# EAGLE design system_monitor (EAGLE 5.09)
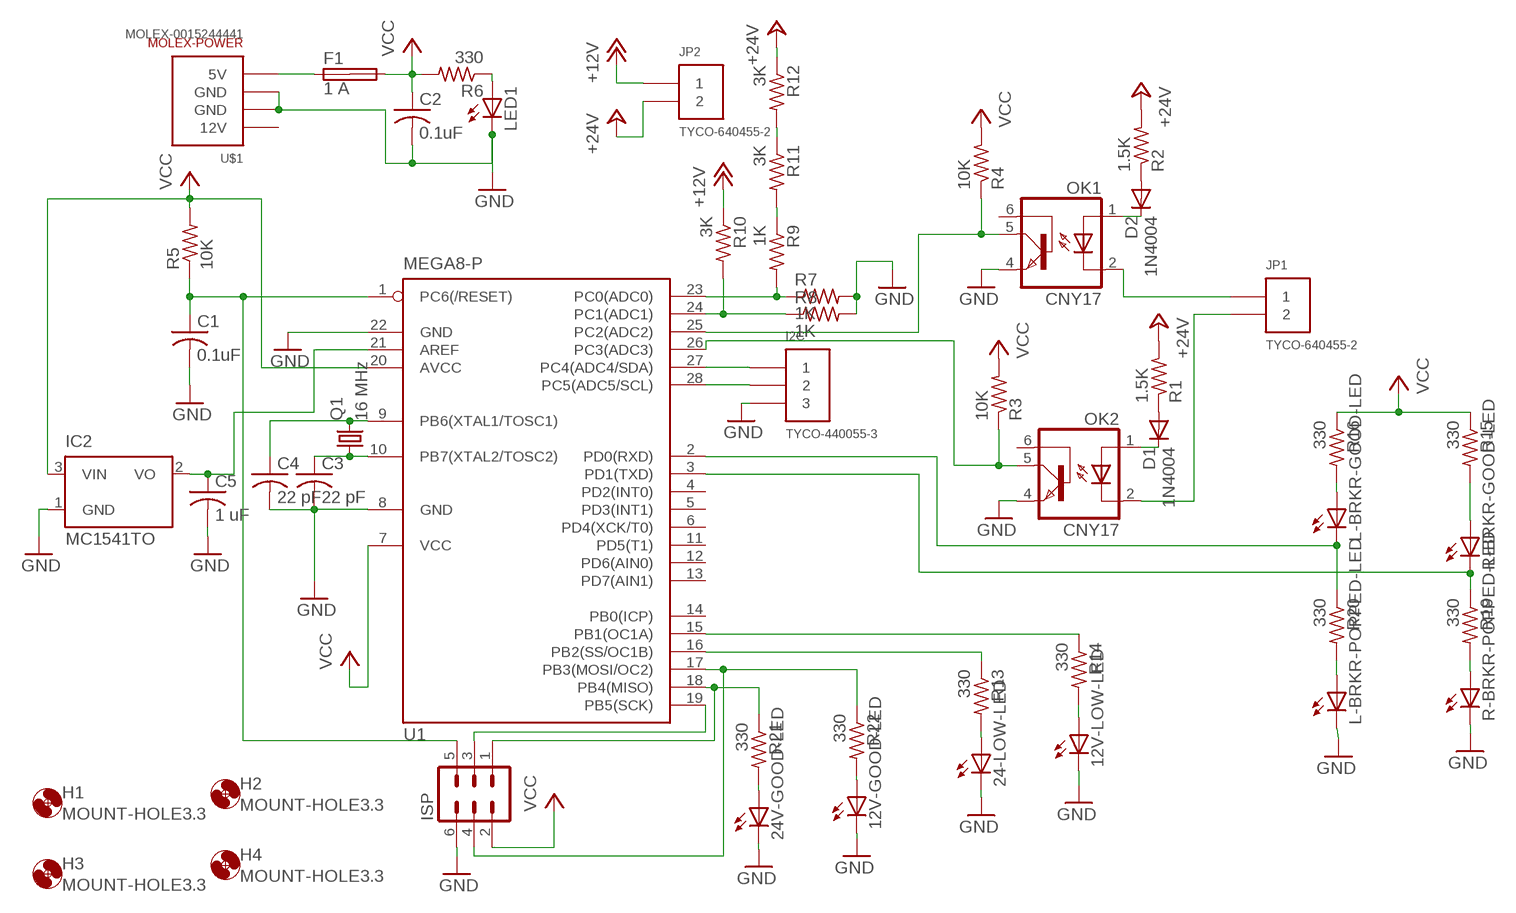
[diagram p0: schematic, sheet 1]

## Parts
12V-GOOD-LED  LED3MM  [LED3MM]
12V-LOW-LED  LED3MM  [LED3MM]
24-LOW-LED  LED3MM  [LED3MM]
24V-GOOD-LED  LED3MM  [LED3MM]
C1  0.1uF  C-US050-055X075  [C050-055X075]
C2  0.1uF  C-US050-055X075  [C050-055X075]
C3  22 pF  C-US025-025X050  [C025-025X050]
C4  22 pF  C-US025-025X050  [C025-025X050]
C5  1 uF  C-US050-025X075  [C050-025X075]
D1  1N4004  [DO41-10]
D2  1N4004  [DO41-10]
F1  1 A  SHK20Q  [SHK20Q]
H1  MOUNT-HOLE3.3  [3,3]
H2  MOUNT-HOLE3.3  [3,3]
H3  MOUNT-HOLE3.3  [3,3]
H4  MOUNT-HOLE3.3  [3,3]
I2C  TYCO-440055-3  [HEADER-RA-2.00MM-3]
IC2  MC1541TO  [TO92]
ISP  MA03-2  [MA03-2]
JP1  TYCO-640455-2  [HEADER-RA-POL-.100IN-2]
JP2  TYCO-640455-2  [HEADER-RA-POL-.100IN-2]
L-BRKR-GOOD-LED  LED3MM  [LED3MM]
L-BRKR-POPPED-LED  LED3MM  [LED3MM]
LED1  LED3MM  [LED3MM]
OK1  CNY17  [DIL06]
OK2  CNY17  [DIL06]
Q1  16 MHz  CRYSTALHC49S  [HC49/S]
R1  1.5K  R-US_0207/10  [0207/10]
R2  1.5K  R-US_0207/10  [0207/10]
R3  10K  R-US_0207/10  [0207/10]
R4  10K  R-US_0207/10  [0207/10]
R5  10K  R-US_0207/10  [0207/10]
R6  330  R-US_0207/10  [0207/10]
R7  1K  R-US_0207/10  [0207/10]
R8  1K  R-US_0207/10  [0207/10]
R9  1K  R-US_0207/10  [0207/10]
R10  3K  R-US_0207/10  [0207/10]
R11  3K  R-US_0207/10  [0207/10]
R12  3K  R-US_0207/10  [0207/10]
R13  330  R-US_0207/10  [0207/10]
R14  330  R-US_0207/10  [0207/10]
R15  330  R-US_0207/10  [0207/10]
R16  330  R-US_0207/10  [0207/10]
R19  330  R-US_0207/10  [0207/10]
R20  330  R-US_0207/10  [0207/10]
R21  330  R-US_0207/10  [0207/10]
R22  330  R-US_0207/10  [0207/10]
R-BRKR-GOOD-LED  LED3MM  [LED3MM]
R-BRKR-POPPED-LED  LED3MM  [LED3MM]
U1  MEGA8-P  [DIL28-3]
U$1  MOLEX-0015244441  [MOLEX-0015244441B]

## Nets
+12V: JP2.1 R10.1
+24V: JP2.2 R1.2 R2.2 R12.1
GND: 12V-GOOD-LED.K(C) 12V-LOW-LED.K(C) 24-LOW-LED.K(C) 24V-GOOD-LED.K(C) C1.2 C2.2 C3.2 C4.2 C5.2 I2C.3 IC2.1(GND) ISP.6 L-BRKR-POPPED-LED.K(C) LED1.K(C) OK1.4(EMI) OK2.4(EMI) R7.2 R8.2 R-BRKR-POPPED-LED.K(C) U1.8(GND) U1.22(GND) U$1.2(GND) U$1.3(GND)
N$1: D1.A R1.1
N$2: D2.A R2.1
N$3: D1.C OK2.1(A)
N$4: C1.1 ISP.5 R5.1 U1.1(PC6(/RESET))
N$5: C3.1 Q1.1 U1.10(PB7(XTAL2/TOSC2))
N$6: OK2.5(COL) R3.1 U1.26(PC3(ADC3))
N$7: C4.1 Q1.2 U1.9(PB6(XTAL1/TOSC1))
N$8: OK1.5(COL) R4.1 U1.25(PC2(ADC2))
N$9: F1.1A U$1.4(5V)
N$10: R8.1 R10.2 U1.24(PC1(ADC1))
N$11: R11.1 R12.2
N$12: R9.1 R11.2
N$13: I2C.1 U1.27(PC4(ADC4/SDA))
N$14: I2C.2 U1.28(PC5(ADC5/SCL))
N$15: R7.1 R9.2 U1.23(PC0(ADC0))
N$16: JP1.1 OK1.2(C)
N$17: JP1.2 OK2.2(C)
N$18: R13.1 U1.16(PB2(SS/OC1B))
N$19: R14.1 U1.15(PB1(OC1A))
N$20: 24V-GOOD-LED.A R21.2
N$21: 12V-GOOD-LED.A R22.2
N$22: D2.C OK1.1(A)
N$23: ISP.1 R21.1 U1.18(PB4(MISO))
N$24: C5.1 IC2.2(VO) U1.21(AREF)
N$25: L-BRKR-GOOD-LED.K(C) R20.1 U1.2(PD0(RXD))
N$26: R19.1 R-BRKR-GOOD-LED.K(C) U1.3(PD1(TXD))
N$27: 24-LOW-LED.A R13.2
N$28: LED1.A R6.1
N$29: 12V-LOW-LED.A R14.2
N$30: R15.2 R-BRKR-GOOD-LED.A
N$31: ISP.3 U1.19(PB5(SCK))
N$32: L-BRKR-POPPED-LED.A R20.2
N$33: ISP.4 R22.1 U1.17(PB3(MOSI/OC2))
N$34: L-BRKR-GOOD-LED.A R16.2
N$35: R19.2 R-BRKR-POPPED-LED.A
VCC: C2.1 F1.2A IC2.3(VIN) ISP.2 R3.2 R4.2 R5.2 R6.2 R15.1 R16.1 U1.7(VCC) U1.20(AVCC)
Unconnected: F1.1B F1.2B OK1.6(BAS) OK2.6(BAS) U1.4(PD2(INT0)) U1.5(PD3(INT1)) U1.6(PD4(XCK/T0)) U1.11(PD5(T1)) U1.12(PD6(AIN0)) U1.13(PD7(AIN1)) U1.14(PB0(ICP))

## Power pins joined to a net without a drawn wire
12V: U$1.1(12V)

## Library data of the parts
12V-GOOD-LED 12V-LOW-LED 24-LOW-LED 24V-GOOD-LED L-BRKR-GOOD-LED L-BRKR-POPPED-LED LED1 R-BRKR-GOOD-LED R-BRKR-POPPED-LED = led:LED: LED OSRAM: - CHIPLED LG R971, LG N971, LY N971, LG Q971, LY Q971, LO R971, LY R971 LH N974, LH R974 LS Q976, LO Q976, LY Q976 LO Q996 - Hyper CHIPLED LW Q18S LB Q993, LB Q99A, LB R99A - SideLED LS A670, LO A670, LY A670, LG A670, LP A670 LB A673, LV A673, LT A673, LW A673 LH A674 LY A675 LS A676, LA A676, LO A676, LY A676, LW A676 LS A679, LY A679, LG A679 - Hyper Micro SIDELED® LS Y876, LA Y876, LO Y876, LY Y876 LT Y87S - SmartLED LW L88C, LW L88S LB L89C, LB L89S, LG L890 LS L89K, LO L89K, LY L89K LS L896, LA L896, LO L896, LY L896 - TOPLED LS T670, LO T670, LY T670, LG T670, LP T670 LSG T670, LSP T670, LSY T670, LOP T670, LYG T670 LG T671, LOG T671, LSG T671 LB T673, LV T673, LT T673, LW T673 LH T674 LS T676, LA T676, LO T676, LY T676, LB T676, LH T676, LSB T676, LW T676 LB T67C, LV T67C, LT T67C, LS T67K, LO T67K, LY T67K, LW E67C LS E67B, LA E67B, LO E67B, LY E67B, LB E67C, LV E67C, LT E67C LW T67C LS T679, LY T679, LG T679 LS T770, LO T770, LY T770, LG T770, LP T770 LB T773, LV T773, LT T773, LW T773 LH T774 LS E675, LA E675, LY E675, LS T675 LS T776, LA T776, LO T776, LY T776, LB T776 LHGB T686 LT T68C, LB T68C - Hyper Mini TOPLED® LB M676 - Mini TOPLED Santana® LG M470 LS M47K, LO M47K, LY M47K Source: http://www.osram.convergy.de LUXEON: - LUMILED® LXK2-PW12-R00, LXK2-PW12-S00, LXK2-PW14-U00, LXK2-PW14-V00 LXK2-PM12-R00, LXK2-PM12-S00, LXK2-PM14-U00 LXK2-PE12-Q00, LXK2-PE12-R00, LXK2-PE12-S00, LXK2-PE14-T00, LXK2-PE14-U00 LXK2-PB12-K00, LXK2-PB12-L00, LXK2-PB12-M00, LXK2-PB14-N00, LXK2-PB14-P00, LXK2-PB14-Q00 LXK2-PR12-L00, LXK2-PR12-M00, LXK2-PR14-Q00, LXK2-PR14-R00 LXK2-PD12-Q00, LXK2-PD12-R00, LXK2-PD12-S00 LXK2-PH12-R00, LXK2-PH12-S00 LXK2-PL12-P00, LXK2-PL12-Q00, LXK2-PL12-R00 Source: www.luxeon.com KINGBRIGHT: KA-3528ASYC Source: www.kingbright.com
C1-C5 = resistor:C-US: CAPACITOR, American symbol
D1 D2 = diode:1N4004: DIODE general purpose rectifier, 1 A
F1 = fuse:SHK20Q: FUSE HOLDER 5 x 20 mm, SH contact, E1207 Buerklin 64G6061
H1-H4 = holes:MOUNT-HOLE: MOUNTING HOLE with drill center marker
I2C = chicagoedt:TYCO-440055-3: 3 pin right angle header with shroud and 2.00 mm pitch.
IC2 = microchip:MC15*: 2.5V and 4.096V Voltage References Source: http://www.microchip.com .. 21653b.pdf
ISP = con-lstb:MA03-2: PIN HEADER
JP1 JP2 = chicagoedt:TYCO-640455-2: 2 pin right angle header with polarizing tab and .100" pitch.
OK1 OK2 = optocoupler:CNY17: SIEMENS OPTO COUPLER
Q1 = crystal:CRYSTAL: CRYSTAL
R1-R16 R19-R22 = resistor:R-US_: RESISTOR, American symbol
U1 = atmel:MEGA8-P: MICROCONTROLLER 8 Kbytes FLASH, 1 kbytes SRAM, 512 bytes EEPROM, USART, 4-channel 10 bit ADC, 2-channel 8 bit ADC Pin compatible with Atmega48, ATMega88, ATMega168 Source: avr.lbr
U$1 = chicagoedt:MOLEX-0015244441: 5.08mm (.200") Pitch Disk Drive Power Connection System Header, Right Angle, Through Hole, 4 Circuits, Lead-free, 3.56mm (.140") PC Tail Length, with PCB Locator Peg

## Board
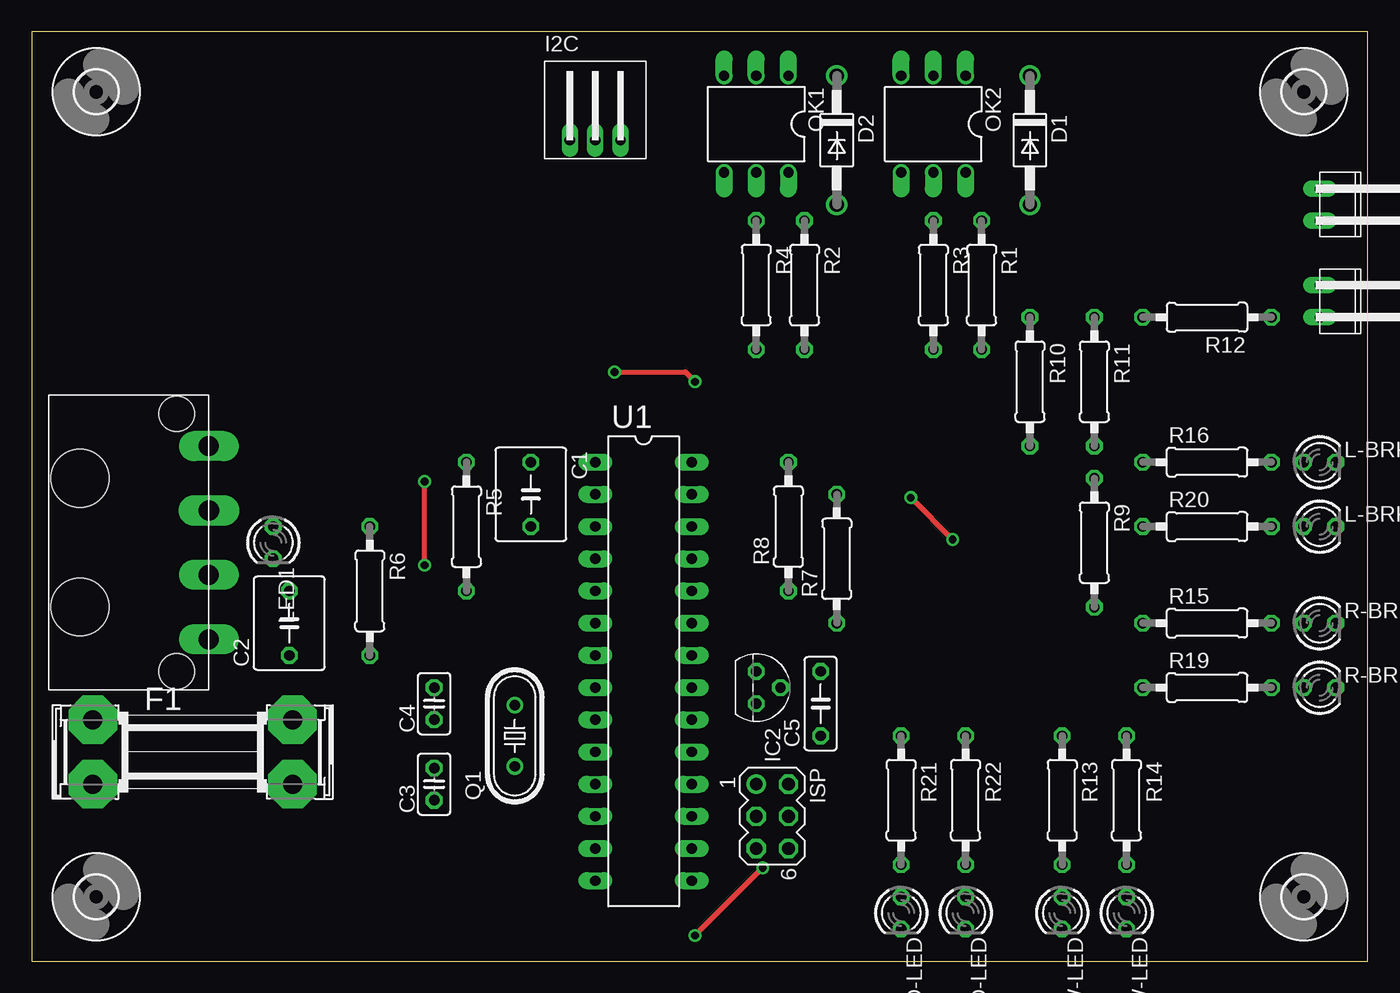
[diagram p1: board, top side]
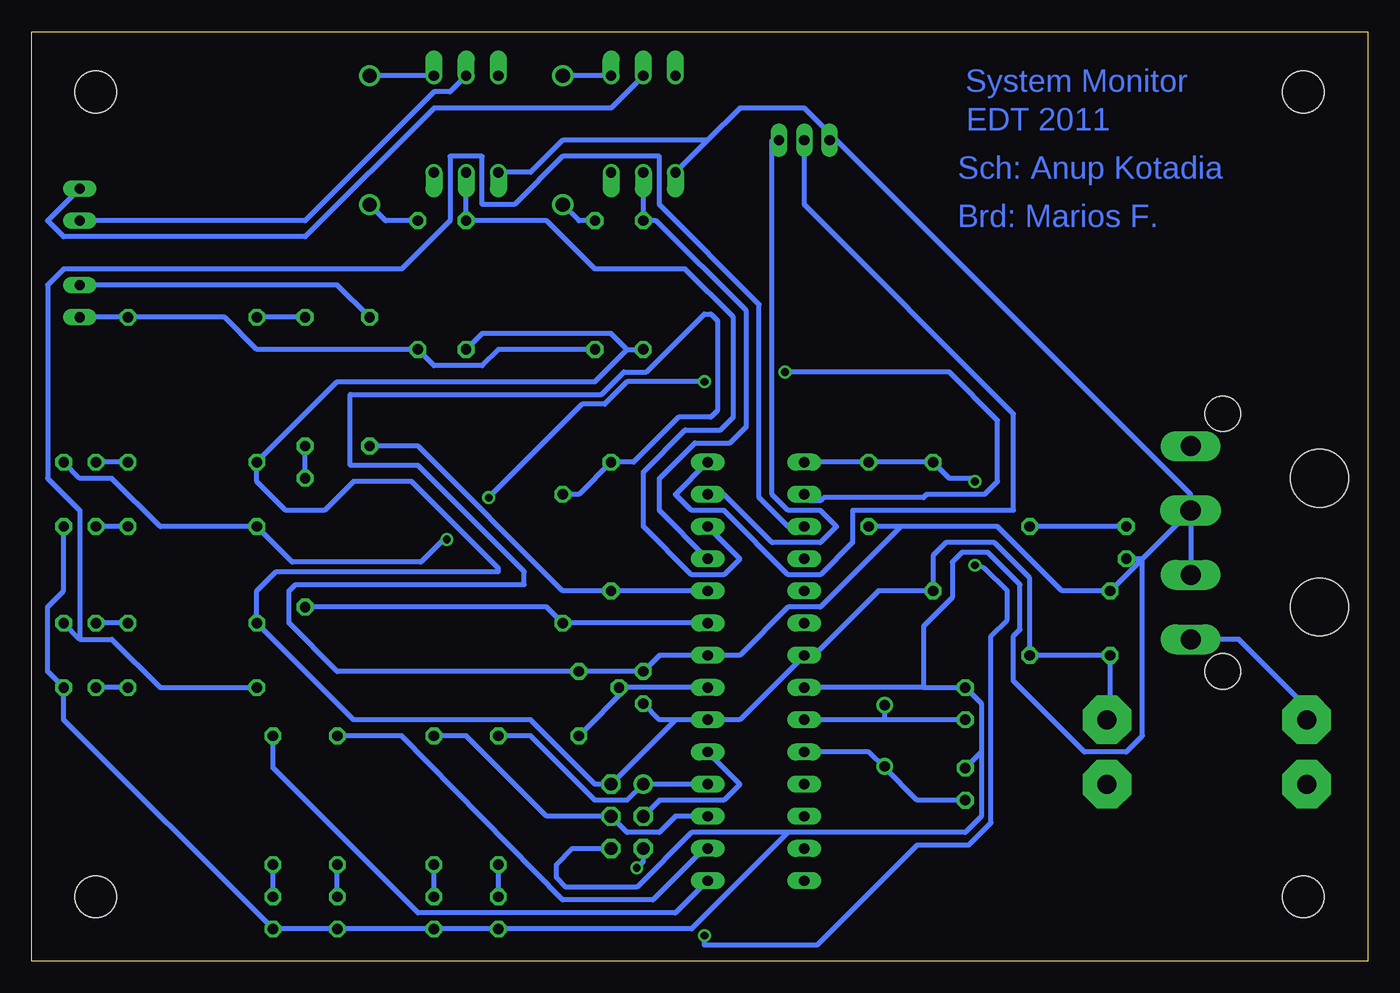
[diagram p2: board, bottom side, seen from below]

Size 105.39 x 73.33 mm. Coordinates in mm from the lower left corner, seen from the top.
Outline: 0,0 105.39,0 105.39,73.33 0,73.33 0,0
Copper layers (1*16): Top 0.035mm / dielectric 1.5mm / Bottom 0.035mm
Design rules "default *": minimum track width 16mil, minimum drill 24mil, track to track 12mil, track to pad 10mil, pad to pad 8mil, via to via 8mil, smd to smd 8mil, copper to edge 40mil, drill to drill 8mil, minimum pad ring 10mil, minimum via ring 8mil, stop-mask expansion 4mil, vias tented up to drill 0mil, thermal gap 10mil

### Footprints (pad centres in the part's own frame; a part is rotated, then mirrored left to right if it is on the bottom)
LED3MM = drill 0.813 octagon: A -1.27,0; K 1.27,0
C050-055X075 = drill 0.813 octagon: 1 -2.54,0; 2 2.54,0
C025-025X050 = drill 0.813 octagon: 1 -1.27,0; 2 1.27,0
C050-025X075 = drill 0.813 octagon: 1 -2.54,0; 2 2.54,0
DO41-10 = drill 1.118 round: A 5.08,0; C -5.08,0
SHK20Q = drill 1.5 pad 3.81 octagon: 1A -7.874,2.54; 1B -7.874,-2.54; 2A 7.874,2.54; 2B 7.874,-2.54
3,3 = hole 3.3: 0,0
HEADER-RA-2.00MM-3 = drill 0.8 long: 1 2,0; 2 0,0; 3 -2,0
TO92 = drill 0.813 octagon: 1 -1.27,0; 2 0,1.905; 3 1.27,0
MA03-2 = drill 1.016 round: 1 -2.54,-1.27 | drill 1.016 octagon: 2 -2.54,1.27; 3 0,-1.27; 4 0,1.27; 5 2.54,-1.27; 6 2.54,1.27
HEADER-RA-POL-.100IN-2 = drill 0.8 long: 1 -1.27,-5.08; 2 1.27,-5.08
DIL06 = drill 0.813 offset: 1 -2.54,-3.81; 2 0,-3.81; 3 2.54,-3.81; 4 2.54,3.81; 5 0,3.81; 6 -2.54,3.81
HC49/S = drill 0.813 round: 1 -2.413,0; 2 2.413,0
0207/10 = drill 0.813 octagon: 1 -5.08,0; 2 5.08,0
DIL28-3 = drill 0.813 long: 1 -16.51,-3.81; 2 -13.97,-3.81; 3 -11.43,-3.81; 4 -8.89,-3.81; 5 -6.35,-3.81; 6 -3.81,-3.81; 7 -1.27,-3.81; 8 1.27,-3.81; 9 3.81,-3.81; 10 6.35,-3.81; 11 8.89,-3.81; 12 11.43,-3.81; 13 13.97,-3.81; 14 16.51,-3.81; 15 16.51,3.81; 16 13.97,3.81; 17 11.43,3.81; 18 8.89,3.81; 19 6.35,3.81; 20 3.81,3.81; 21 1.27,3.81; 22 -1.27,3.81; 23 -3.81,3.81; 24 -6.35,3.81; 25 -8.89,3.81; 26 -11.43,3.81; 27 -13.97,3.81; 28 -16.51,3.81
MOLEX-0015244441B = drill 1.587 pad 1.778 long: 1 7.62,-6.35; 3 -2.54,-6.35; 4 -7.62,-6.35 | drill 1.6 pad 1.651 long: 2 2.54,-6.35 | hole 2.794: -10.16,-3.81; 10.16,-3.81 | hole 4.572: -5.08,3.81; 5.08,3.81

### Placement (x,y rotation side)
12V-GOOD-LED  73.66,3.81 270 top
12V-LOW-LED  86.36,3.81 270 top
24-LOW-LED  81.28,3.81 270 top
24V-GOOD-LED  68.58,3.81 270 top
C1  39.37,36.83 270 top
C2  20.32,26.67 90 top
C3  31.75,13.97 90 top
C4  31.75,20.32 90 top
C5  62.23,20.32 90 top
D1  78.74,64.77 270 top
D2  63.5,64.77 270 top
F1  12.7,16.51 0 top
H1  100.33,68.58 0 top
H2  5.08,68.58 0 top
H3  5.08,5.08 0 top
H4  100.33,5.08 0 top
I2C  44.45,64.77 0 top
IC2  57.15,21.59 270 top
ISP  58.42,11.43 270 top
JP1  106.68,59.69 270 top
JP2  106.68,52.07 270 top
L-BRKR-GOOD-LED  101.6,39.37 0 top
L-BRKR-POPPED-LED  101.6,34.29 0 top
LED1  19.05,33.02 270 top
OK1  57.15,66.04 180 top
OK2  71.12,66.04 180 top
Q1  38.1,17.78 90 top
R1  74.93,53.34 270 top
R2  60.96,53.34 270 top
R3  71.12,53.34 270 top
R4  57.15,53.34 270 top
R5  34.29,34.29 270 top
R6  26.67,29.21 270 top
R7  63.5,31.75 90 top
R8  59.69,34.29 90 top
R9  83.82,33.02 270 top
R10  78.74,45.72 270 top
R11  83.82,45.72 270 top
R12  92.71,50.8 180 top
R13  81.28,12.7 270 top
R14  86.36,12.7 270 top
R15  92.71,26.67 0 top
R16  92.71,39.37 0 top
R19  92.71,21.59 0 top
R20  92.71,34.29 0 top
R21  68.58,12.7 270 top
R22  73.66,12.7 270 top
R-BRKR-GOOD-LED  101.6,26.67 0 top
R-BRKR-POPPED-LED  101.6,21.59 0 top
U1  48.26,22.86 270 top
U$1  7.62,33.02 90 top

### Tracks (layer width: path | path; a pad name or v marks a point on that pad's centre or on a via)
+12V
  Bottom 0.406: JP2.1 81.28,53.34 R10.1
+24V
  Bottom 0.406: JP2.2 R12.1 90.17,50.8 87.63,48.26 R1.2 73.66,46.99 69.85,46.99 68.58,48.26 R2.2
GND
  Bottom 0.406: L-BRKR-POPPED-LED.K 102.87,29.21 104.14,27.94 104.14,22.86 R-BRKR-POPPED-LED.K 102.87,19.05 12V-LOW-LED.K 24-LOW-LED.K 12V-GOOD-LED.K 24V-GOOD-LED.K 53.34,2.54 45.72,10.16 | R7.2 62.23,36.83 R8.2 57.91,39.37 54.36,42.93 51.82,42.93 51.31,43.43 51.31,50.55 51.82,51.05 52.32,51.05 56.9,46.48 58.67,46.48 60.45,44.7 80.26,44.7 80.26,39.12 74.93,39.12 66.55,30.73 66.55,29.72 84.58,29.72 85.09,29.21 85.09,26.67 81.28,22.86 C5.2 IC2.1 55.88,24.13 U1.22 49.53,24.13 45.72,27.94 43.18,27.94 36.83,34.29 | 30.48,16.51 C3.2 | 30.48,16.51 30.48,20.32 C4.2 35.05,21.59 | 35.05,21.59 U1.8 | ISP.6 62.74,8.89 64.01,7.62 64.01,6.6 63.25,5.84 57.66,5.84 53.34,10.16 45.72,10.16 | 45.72,10.16 31.75,10.16 30.48,11.43 30.48,16.51 | 41.91,64.77 44.45,67.31 49.53,67.31 52.07,64.77 | 52.07,64.77 OK1.4 | OK2.4 66.04,62.23 63.5,64.77 52.07,64.77 | U$1.2 U$1.3 | 17.78,31.75 U$1.2 | 17.78,31.75 C2.2 24.13,29.21 29.21,34.29 36.83,34.29 | 17.78,31.75 LED1.K | 36.83,34.29 C1.2 | 41.91,64.77 13.97,36.83 U$1.2 | 41.91,64.77 I2C.3 | 17.78,31.75 17.78,17.78 19.05,16.51 22.35,16.51 27.94,22.1 27.94,25.65 27.43,26.16 27.43,29.72 29.97,32.26 32,32.26 32.77,31.5 32.77,28.7 35.05,26.42 35.05,21.59
N$1
  Bottom 0.406: R1.1 77.47,58.42 D1.A
N$2
  Bottom 0.406: R2.1 62.23,58.42 D2.A
N$3
  Bottom 0.406: OK2.1 D1.C
N$4  (via drill 0.6)
  Top 0.406: v30.99,31.24 v30.99,37.85 | v52.32,2.03 v57.66,7.37
  Bottom 0.406: U1.1 C1.1 R5.1 33.02,38.1 31.24,38.1 v30.99,37.85 | 30.99,30.99 v30.99,31.24 30.73,31.24 30.23,30.99 28.45,29.21 28.45,26.92 29.72,25.65 29.72,10.92 31.5,9.14 35.56,9.14 43.43,1.27 52.32,1.27 v52.32,2.03 | ISP.5 57.15,7.87 v57.66,7.37
N$5
  Bottom 0.406: C3.1 35.56,12.7 38.1,15.24 | U1.10 39.37,16.51 38.1,15.24 | 38.1,15.24 Q1.1
N$6
  Bottom 0.406: U1.26 49.53,31.75 50.8,30.48 53.34,30.48 57.15,34.29 57.15,38.61 53.85,41.91 51.05,41.91 50.04,42.93 50.04,50.8 53.85,54.61 60.96,54.61 64.77,58.42 R3.1 OK2.5
N$7
  Bottom 0.406: 38.1,19.05 U1.9 | C4.1 38.1,19.05 | 38.1,19.05 Q1.2 38.1,20.32
N$8
  Bottom 0.406: U1.25 55.88,35.56 55.88,38.1 53.09,40.89 50.29,40.89 49.02,42.16 49.02,51.31 56.13,58.42 R4.1 OK1.5
N$9
  Bottom 0.406: U$1.4 10.16,25.4 3.81,19.05 F1.1A
N$10
  Bottom 0.406: U1.24 R8.1 63.5,29.21 74.93,40.64 R10.2
N$11
  Bottom 0.406: R11.1 R12.2
N$12
  Bottom 0.406: R9.1 R11.2
N$13
  Bottom 0.406: U1.27 50.8,36.83 46.99,33.02 43.18,33.02 41.91,34.29 43.18,35.56 45.72,35.56 46.99,36.83 46.99,64.77 I2C.1
N$14
  Bottom 0.406: I2C.2 44.45,59.69 27.94,43.18 27.94,35.56 40.64,35.56 40.64,33.02 43.18,30.48 45.72,30.48 50.8,35.56 53.34,35.56 54.61,36.83 U1.28
N$15
  Bottom 0.406: U1.23 R7.1 64.77,27.94 R9.2
N$16
  Bottom 0.406: JP1.1 104.14,58.42 102.87,57.15 83.82,57.15 73.66,67.31 59.69,67.31 OK1.2
N$17
  Bottom 0.406: JP1.2 83.82,58.42 73.66,68.58 72.39,68.58 OK2.2
N$18
  Bottom 0.406: U1.16 52.58,8.64 56.39,4.83 63.5,4.83 76.2,17.78 R13.1
N$19
  Bottom 0.406: U1.15 54.61,3.81 74.93,3.81 86.36,15.24 R14.1
N$20
  Bottom 0.406: 24V-GOOD-LED.A R21.2
N$21
  Bottom 0.406: 12V-GOOD-LED.A R22.2
N$22
  Bottom 0.406: OK1.1 D2.C
N$23
  Bottom 0.406: U1.18 ISP.1 58.42,12.7 60.96,12.7 66.04,17.78 R21.1
N$24
  Bottom 0.406: U1.21 58.42,21.59 | 58.42,21.59 C5.1 | 58.42,21.59 IC2.2
N$25  (via drill 0.6)
  Top 0.406: v69.34,36.58 v72.64,33.27 | v45.97,46.48 51.56,46.48 v52.32,45.72
  Bottom 0.406: L-BRKR-GOOD-LED.K 101.6,38.1 99.06,38.1 95.25,34.29 R20.1 84.84,31.5 74.68,31.5 72.9,33.27 v72.64,33.27 | 69.6,36.58 v69.34,36.58 61.98,43.94 60.2,43.94 58.42,45.72 v52.32,45.72 | v45.97,46.48 33.02,46.48 29.21,42.67 29.21,37.85 30.23,36.83 34.8,36.83 35.05,36.58 42.93,36.58 43.18,36.32 43.94,36.32 U1.2
N$26
  Bottom 0.406: R19.1 95.25,21.59 99.06,25.4 101.6,25.4 | 101.6,25.4 R-BRKR-GOOD-LED.K | U1.3 45.72,34.29 48.01,36.58 48.01,51.82 55.88,59.69 55.88,63.5 63.5,63.5 67.31,59.69 69.85,59.69 69.85,63.5 72.39,63.5 72.39,58.42 76.2,54.61 102.87,54.61 104.14,53.34 104.14,38.1 101.6,35.56 101.6,25.4
N$27
  Bottom 0.406: 24-LOW-LED.A R13.2
N$28
  Bottom 0.406: LED1.A R6.1
N$29
  Bottom 0.406: 12V-LOW-LED.A R14.2
N$30
  Bottom 0.406: R15.2 R-BRKR-GOOD-LED.A
N$31
  Bottom 0.406: U1.19 49.53,13.97 50.8,12.7 55.88,12.7 ISP.3
N$32
  Bottom 0.406: R20.2 L-BRKR-POPPED-LED.A
N$33
  Bottom 0.406: U1.17 54.61,11.43 55.88,10.16 58.42,10.16 ISP.4 64.77,11.43 71.12,17.78 R22.1
N$34
  Bottom 0.406: R16.2 L-BRKR-GOOD-LED.A
N$35
  Bottom 0.406: R19.2 R-BRKR-POPPED-LED.A
VCC
  Bottom 0.406: 58.42,48.26 R4.2 | 58.42,48.26 59.69,49.53 69.85,49.53 R3.2 | 58.42,48.26 60.96,45.72 81.28,45.72 R16.1 87.63,37.85 85.34,35.56 82.3,35.56 80.01,37.85 75.44,37.85 68.58,30.99 68.58,30.73 86.11,30.73 87.63,29.21 R15.1 80.01,19.05 66.04,19.05 60.96,13.97 ISP.2 54.61,19.05 | 54.61,19.05 55.88,19.05 IC2.3 | 54.61,19.05 U1.20 49.53,19.05 U1.7 43.69,24.13 38.61,29.21 R5.2 34.29,32 33.27,33.02 29.46,33.02 26.67,30.23 R6.2 C2.1 20.32,19.05 F1.2A

### Text on the board
Bottom: System Monitor | EDT 2011 | Sch: Anup Kotadia | Brd: Marios F.